# Altium project inverter.PrjPcb
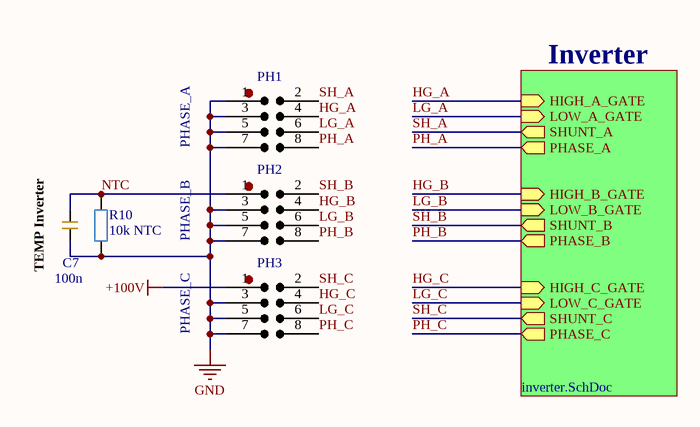
[diagram p0: Overview.SchDoc]
2 sheets, 26 parts. Net scope: hierarchical (ports join the sheet entries above them; power ports are global).
Board file: inverter.PcbDoc
Sheets:
  Overview.SchDoc
    Inverter = inverter.SchDoc

## Sheet Overview.SchDoc
size A3; SheetNumber: 1; SheetTotal: 2

### Parts
C7  100n  [CAP_0603]
PH1  PHASE_A  [PH_2x4_F]
PH2  PHASE_B  [PH_2x4_F]
PH3  PHASE_C  [PH_2x4_F]
R10  10k NTC  [RES_0603]

### Sub-sheets
Inverter = inverter.SchDoc: HIGH_C_GATE (in), LOW_C_GATE (in), HIGH_B_GATE (in), LOW_B_GATE (in), HIGH_A_GATE (in), LOW_A_GATE (in), SHUNT_C (out), SHUNT_B (out), SHUNT_A (out), PHASE_A (out), PHASE_B (out), PHASE_C (out)

### Nets
+100V: PH3.1
GND: C7.1 PH1.1 PH1.3 PH1.5 PH1.7 PH2.3 PH2.5 PH2.7 PH3.3 PH3.5 PH3.7 R10.1
HG_A: PH1.4 ; sheet Inverter/HIGH_A_GATE
HG_B: PH2.4 ; sheet Inverter/HIGH_B_GATE
HG_C: PH3.4 ; sheet Inverter/HIGH_C_GATE
LG_A: PH1.6 ; sheet Inverter/LOW_A_GATE
LG_B: PH2.6 ; sheet Inverter/LOW_B_GATE
LG_C: PH3.6 ; sheet Inverter/LOW_C_GATE
NTC: C7.2 PH2.1 R10.2
PH_A: PH1.8 ; sheet Inverter/PHASE_A
PH_B: PH2.8 ; sheet Inverter/PHASE_B
PH_C: PH3.8 ; sheet Inverter/PHASE_C
SH_A: PH1.2 ; sheet Inverter/SHUNT_A
SH_B: PH2.2 ; sheet Inverter/SHUNT_B
SH_C: PH3.2 ; sheet Inverter/SHUNT_C

### Notes on the sheet
- (near C7) TEMP Inverter

### Library data of the parts
C7 = CAP_0603: Multilayer Ceramic Capacitors MLCC - SMD/SMT ROHS; Mfr.: *; Voltage Rating: *; Package: 0603; LCSC: *; Mfr. Part: *
PH1-PH3 = PH_2x4_F: 2.54mm 2.54mm Double Row 3A Copper alloy 10P -40℃~+105℃ Bend-in 2x5P Side 8.5mm Square Hole Push-Pull,P=2.54mm Female Headers ROHS; Mfr.: HCTL; Mfr. Part: PM254-2-04-W-8.5; LCSC: C2897424
R10 = RES_0603: 100mW Thick Film Resistors; Voltage Rating: *; Mfr. Part: *; Package: 0603; LCSC: *; Mfr.: *

## Sheet inverter.SchDoc
size A3; SheetNumber: 2; SheetTotal: 2
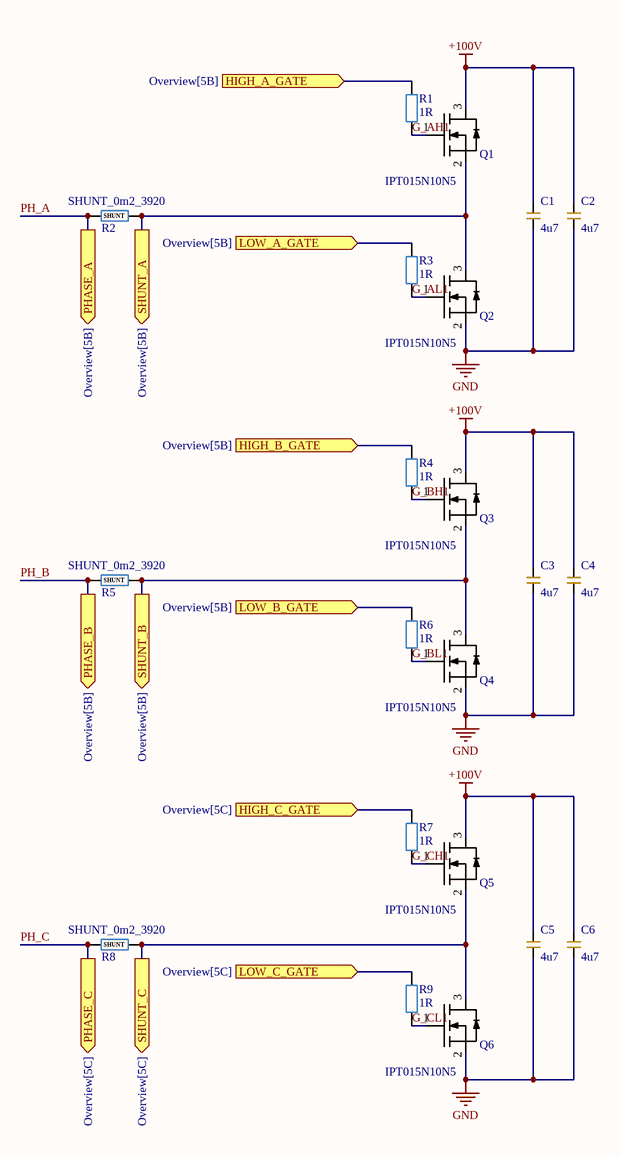
[diagram p1: inverter.SchDoc]

### Parts
C1  4u7  [FS32X475K101EGG]
C2  4u7  [FS32X475K101EGG]
C3  4u7  [FS32X475K101EGG]
C4  4u7  [FS32X475K101EGG]
C5  4u7  [FS32X475K101EGG]
C6  4u7  [FS32X475K101EGG]
Q1  IPT015N10N5  [IPT015N10N5]
Q2  IPT015N10N5  [IPT015N10N5]
Q3  IPT015N10N5  [IPT015N10N5]
Q4  IPT015N10N5  [IPT015N10N5]
Q5  IPT015N10N5  [IPT015N10N5]
Q6  IPT015N10N5  [IPT015N10N5]
R1  1R  [RES_0805]
R2  SHUNT_0m2_3920  [ASR-M-5-0.2F-t1]
R3  1R  [RES_0805]
R4  1R  [RES_0805]
R5  SHUNT_0m2_3920  [ASR-M-5-0.2F-t1]
R6  1R  [RES_0805]
R7  1R  [RES_0805]
R8  SHUNT_0m2_3920  [ASR-M-5-0.2F-t1]
R9  1R  [RES_0805]

### Ports
HIGH_A_GATE (in, see Overview[5B]), HIGH_B_GATE (in, see Overview[5B]), HIGH_C_GATE (in, see Overview[5C]), LOW_A_GATE (in, see Overview[5B]), LOW_B_GATE (in, see Overview[5B]), LOW_C_GATE (in, see Overview[5C]), PHASE_A (out, see Overview[5B]), PHASE_B (out, see Overview[5B]), PHASE_C (out, see Overview[5C]), SHUNT_A (out, see Overview[5B]), SHUNT_B (out, see Overview[5B]), SHUNT_C (out, see Overview[5C])

### Nets
+100V: C1.2 C2.2 C3.2 C4.2 C5.2 C6.2 Q1.3 Q3.3 Q5.3
GND: C1.1 C2.1 C3.1 C4.1 C5.1 C6.1 Q2.2 Q4.2 Q6.2
G_AH1: Q1.1(G) R1.1
G_AL1: Q2.1(G) R3.1
G_BH1: Q3.1(G) R4.1
G_BL1: Q4.1(G) R6.1
G_CH1: Q5.1(G) R7.1
G_CL1: Q6.1(G) R9.1
HG_A: R1.2 ; port HIGH_A_GATE
HG_B: R4.2 ; port HIGH_B_GATE
HG_C: R7.2 ; port HIGH_C_GATE
LG_A: R3.2 ; port LOW_A_GATE
LG_B: R6.2 ; port LOW_B_GATE
LG_C: R9.2 ; port LOW_C_GATE
PH_A: R2.1 ; port PHASE_A
PH_B: R5.1 ; port PHASE_B
PH_C: R8.1 ; port PHASE_C
SH_A: Q1.2 Q2.3 R2.2 ; port SHUNT_A
SH_B: Q3.2 Q4.3 R5.2 ; port SHUNT_B
SH_C: Q5.2 Q6.3 R8.2 ; port SHUNT_C

### Notes on the sheet
- (in symbol SHUNT_0m2_3920) SHUNT

### Library data of the parts
C1-C6 = 4u7: 100V 4.7uF X7R ±10% 1210 Multilayer Ceramic Capacitors MLCC - SMD/SMT ROHS; Mfr.: PSA(Prosperity Dielectrics); Voltage Rating: 100V; Package: 1210; LCSC: C381466; Mfr. Part: FS32X475K101EGG
Q1-Q6 = IPT015N10N5: 100V 500A 533W 1.35mΩ 1 N-channel HSOF-8 MOSFETs ROHS; Mfr.: Tokmas; LCSC: C19626223; Mfr. Part: IPT015N10N5
R1 R3 R4 R6 R7 R9 = RES_0805: Resistor SMD 0805 Generic; Mfr.: *; Voltage Rating: *; Mfr. Part: *; Package: 0805; LCSC: *; Power Rating: *
R2 R5 R8 = SHUNT_0m2_3920: 12W 0.2mΩ Patch Splitter ±200ppm/℃ ±1% 3920 Current Sense Resistors / Shunt Resistors ROHS; Mfr.: Shenzhen Yezhan Elec.; Mfr. Part: ASR-M-5-0.2F-t1; LCSC: C469432

## Nets that join several sheets
+100V: Overview (PH3.1), inverter (9 pins)
GND: Overview (12 pins), inverter (9 pins)
HG_A: Overview (PH1.4), inverter (R1.2)
HG_B: Overview (PH2.4), inverter (R4.2)
HG_C: Overview (PH3.4), inverter (R7.2)
LG_A: Overview (PH1.6), inverter (R3.2)
LG_B: Overview (PH2.6), inverter (R6.2)
LG_C: Overview (PH3.6), inverter (R9.2)
PH_A: Overview (PH1.8), inverter (R2.1)
PH_B: Overview (PH2.8), inverter (R5.1)
PH_C: Overview (PH3.8), inverter (R8.1)
SH_A: Overview (PH1.2), inverter (Q1.2 Q2.3 R2.2)
SH_B: Overview (PH2.2), inverter (Q3.2 Q4.3 R5.2)
SH_C: Overview (PH3.2), inverter (Q5.2 Q6.3 R8.2)